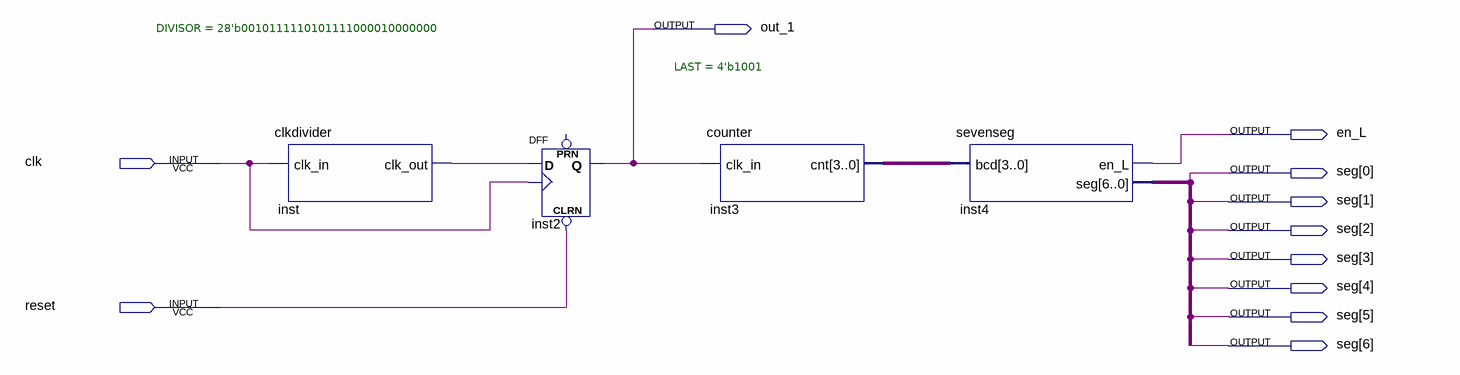
[diagram p0: schematic sheet]
// Quartus schematic weatherstation.bdf as structural Verilog: 4 symbols, 11 pins
module weatherstation (
  input  clk,
  input  reset,
  output out_1,
  output en_L,
  output [6:0] seg
);

  wire inst_clk_out;
  wire [3:0] inst3_cnt;
  wire [6:0] inst4_seg;

  clkdivider #(.DIVISOR(28'b0010111110101111000010000000)) inst (.clk_in(clk), .clk_out(inst_clk_out));
  DFF inst2 (.CLRN(reset), .CLK(clk), .D(inst_clk_out), .Q(out_1));  // open: PRN
  counter #(.LAST(4'b1001)) inst3 (.clk_in(out_1), .cnt(inst3_cnt));
  sevenseg inst4 (.bcd(inst3_cnt), .en_L(en_L), .seg(inst4_seg));
endmodule
